# Altium schematic sheet [4] TFT LCD.SchDoc: TFT LCD
size A4; ApprovedBy: Muhammet YILDIZ; CheckedBy: Muhammet YILDIZ; Author: Muhammet YILDIZ; CompanyName: YıLDıZ IoT; DrawnBy: Muhammet YILDIZ; Engineer: Muhammet YILDIZ; Organization: YıLDıZ IoT; Address1: Elperek Mahallesi; Address2: Saray Sokak No:12; Address3: SAKARYA / TURKEY; Revision: 1; SheetNumber: 4; SheetTotal: 7; SheetSize: A4
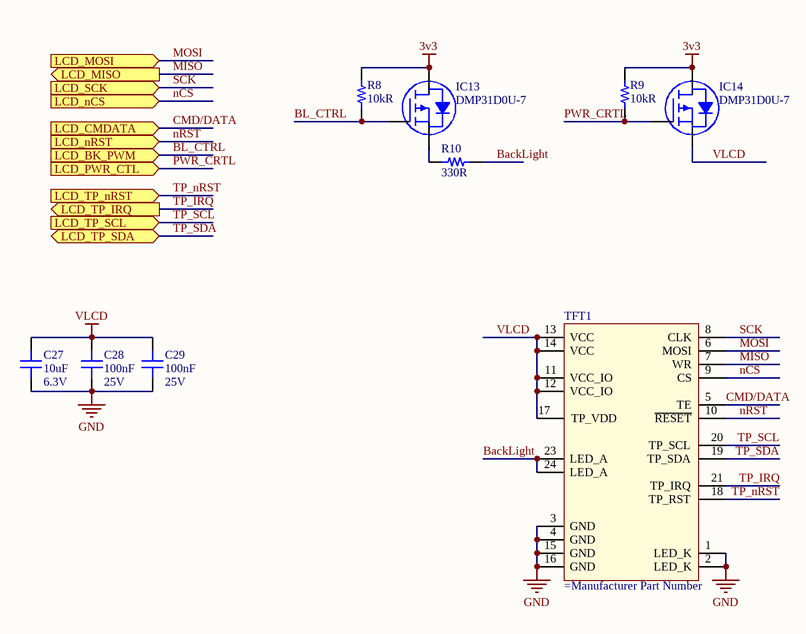
[diagram p0: [4] TFT LCD.SchDoc]

## Parts
C27  10uF  Voltage Rating: 6.3V  [CAP 0402/1005]
C28  100nF  Voltage Rating (DC): 25V  [CAP 0402/1005]
C29  100nF  Voltage Rating (DC): 25V  [CAP 0402/1005]
IC13  DMP31D0U-7  [DIODES SOT-23-3]
IC14  DMP31D0U-7  [DIODES SOT-23-3]
R8  10kR  [RES 0402/1005]
R9  10kR  [RES 0402/1005]
R10  330R  [RES 0402/1005]
TFT1  (no value)  [EASTRISE ER-TFT1.28-2]

## Ports
LCD_BK_PWM (in), LCD_CMDATA (in), LCD_MISO (out), LCD_MOSI (in), LCD_nCS (in), LCD_nRST (in), LCD_PWR_CTL (in), LCD_SCK (in), LCD_TP_IRQ (out), LCD_TP_nRST (in), LCD_TP_SCL (in), LCD_TP_SDA (bidir)

## Nets
3v3: IC13.3(D) IC14.3(D) R8.2 R9.2
GND: C27.1 C28.1 C29.1 TFT1.1(LED_K) TFT1.2(LED_K) TFT1.3(GND) TFT1.4(GND) TFT1.15(GND) TFT1.16(GND)
VLCD: C27.2 C28.2 C29.2 IC14.2(S) TFT1.11(VCC_IO) TFT1.12(VCC_IO) TFT1.13(VCC) TFT1.14(VCC) TFT1.17(TP_VDD)
BackLight: R10.2 TFT1.23(LED_A) TFT1.24(LED_A)
BL_CTRL: IC13.1(G) R8.1 ; port LCD_BK_PWM
CMD/DATA: TFT1.5(TE) ; port LCD_CMDATA
MISO: TFT1.7(WR) ; port LCD_MISO
MOSI: TFT1.6(MOSI) ; port LCD_MOSI
nCS: TFT1.9(CS) ; port LCD_nCS
nRST: TFT1.10(~{RESET}) ; port LCD_nRST
PWR_CRTL: IC14.1(G) R9.1 ; port LCD_PWR_CTL
SCK: TFT1.8(CLK) ; port LCD_SCK
TP_IRQ: TFT1.21(TP_IRQ) ; port LCD_TP_IRQ
TP_nRST: TFT1.18(TP_RST) ; port LCD_TP_nRST
TP_SCL: TFT1.20(TP_SCL) ; port LCD_TP_SCL
TP_SDA: TFT1.19(TP_SDA) ; port LCD_TP_SDA
NetIC13_2: IC13.2(S) R10.1

## Notes on the sheet
- Title:
- Size:
- Project:
- Revision:
- Sheet
- of
- Date:
- YıLDıZ IoT
- Elperek Mahallesi
- Saray Sokak, No:12
- SAKARYA / TURKEY
- File:

## Library data of the parts
C27 = Capacitor - Ceramic: 0402 10 uF 6.3 V ±20 % Tolerance X5R Surface Mount Multilayer Ceramic Capacitor; Manufacturer: Murata; Manufacturer Part Number: GRM155R60J106ME15D; Tolerance: 20%; Supplier 1: Digi-Key; Supplier Part Number 1: 490-13238-1-ND; RoHS: Yes; Category: Ceramic Capacitors; Pricing 1: 1=0,18000, 10=0,12400, 50=0,07440, 100=0,06280, 500=0,04296, 1000=0,03800, 2500=0,03635, 5000=0,03304 (USD); Mount: Surface Mount; Case/Package: 0402; Case Code (Metric): 1005; Case Code (Imperial): 0402; Min Operating Temperature: -55°C; Max Operating Temperature: 85°C; Packaging: Tape and Reel; Capacitance: 10uF; Voltage Rating (DC): 6.3V; Dielectric: X5R; Length: 0.039inch; Width: 0.02inch; Thickness: 0.026inch; RoHS Compliant: Yes; ComponentLink1URL: https://www.murata.com/~/media/webrenewal/support/library/catalog/products/capacitor/mlcc/c02e.ashx?la=en-us&src-supplier=Digi-Key; ComponentLink1Description: https://www.murata.com/~/media/webrenewal/support/library/catalog/products/capacitor/mlcc/c02e.ashx?la=en-us&src-supplier=Digi-Key
C28 C29 = Capacitor - Ceramic: Cap Ceramic 0.1uF 25V X5R 10% Pad SMD 0402 85¡ãC T/R / Multi Layer Ceramic Capacitor (MLCC); Manufacturer: Samsung; Manufacturer Part Number: CL05A104KA5NNNC; Supplier 1: Digi-Key; Supplier Part Number 1: 1276-1043-6-ND; RoHS: Yes; Category: Ceramic Capacitors; Pricing 1: 1=0,10000, 10=0,01100, 50=0,00600, 100=0,00490, 500=0,00346, 1000=0,00272, 2500=0,00248, 5000=0,00228 (USD); Mount: Surface Mount; Case/Package: 0402; Case Code (Imperial): 0402; Case Code (Metric): 1005; Min Operating Temperature: -55°C; Max Operating Temperature: 85°C; Capacitance: 100nF; Packaging: Tape and Reel; Tolerance: 10%; Package Quantity: 1; Voltage Rating: 25V; Dielectric: X5R; Voltage: 25V; Length: 1mm; Width: 0.02inch; Height: 0.5mm; Thickness: 0.022inch; Depth: 0.5mm; Radiation Hardening: No; Lead Free: Lead Free; ComponentLink1URL: https://datasheet.ciiva.com/25802/cl05a104ka5nnnc-25802704.pdf?src-supplier=Digi-Key; ComponentLink1Description: https://datasheet.ciiva.com/25802/cl05a104ka5nnnc-25802704.pdf?src-supplier=Digi-Key; ComponentLink2URL: https://datasheet.ciiva.com/16437/cl05a104ka5nnnc-16437369.pdf?src-supplier=Future+Electronics; ComponentLink2Description: https://datasheet.ciiva.com/16437/cl05a104ka5nnnc-16437369.pdf?src-supplier=Future+Electronics; ComponentLink3URL: https://datasheet.ciiva.com/26838/getdatasheetpartid-357412-26838142.pdf?src-supplier=Verical; ComponentLink3Description: https://datasheet.ciiva.com/26838/getdatasheetpartid-357412-26838142.pdf?src-supplier=Verical; ComponentLink4URL: https://datasheet.ciiva.com/26309/mlcc-catalogdownload2013-eng-26309014.pdf?src-supplier=Distrelec; ComponentLink4Description: https://datasheet.ciiva.com/26309/mlcc-catalogdownload2013-eng-26309014.pdf?src-supplier=Distrelec
IC13 IC14 = DMP31D0U-7: MOSFET P-CH 30V 530MA SOT23; Manufacturer: Diodes Incorporated; Current - Continuous Drain (Id) @ 25°C: 530mA (Ta); Drive Voltage (Max Rds On,  Min Rds On): 1.8V, 4.5V; FET Type: P-Channel; Gate Charge (Qg) (Max) @ Vgs: 0.9nC @ 4.5V; Input Capacitance (Ciss) (Max) @ Vds: 76pF @ 15V; Power Dissipation (Max): 450mW (Ta); Rds On (Max) @ Id, Vgs: 1Ohm @ 400mA, 4.5V; Vgs (Max): ±8V; Vgs(th) (Max) @ Id: 1.1V @ 250µA; Part Number: DMP31D0U-7; ComponentLink1Description: Datasheet; ComponentLink1URL: https://www.diodes.com/assets/Datasheets/DMP31D0U.pdf; ComponentLink2Description: DigiKey Link; ComponentLink2URL: http://digikey.com/product-detail/en/diodes-incorporated/DMP31D0U-7/DMP31D0U-7DICT-ND/4457888; Drain to Source Voltage (Vdss): 30V; LastUpdated: 02.09.2020 01:25:04; Lifecycle Status: Active; Minimum Order: 1; Mounting Type: Surface Mount; Operating Temperature: -55°C ~ 150°C (TJ); Package / Case: TO-236-3, SC-59, SOT-23-3; Packaging: TapeAndReel; Part Status: Active; Price: 0.09; Series: -; Supplier 1: DigiKey; Supplier Part Number 1: DMP31D0U-7DICT-ND; Supplier Device Package: SOT-23; Technology: MOSFET (Metal Oxide)
R8 R9 = Resistor_Chip: Res Thick Film 0402 10K Ohm 1% 0.063W(1/16W) ±100ppm/C Pad SMD Automotive T/R; Manufacturer: Stackpole Electronics; Manufacturer Part Number: RMCF0402FT10K0; Power Rating: 62.5mW; Temperature Coefficient: 100ppm/°C; Max Power Dissipation: 63mW; Supplier 1: Digi-Key; Supplier Part Number 1: RMCF0402FT10K0DKR-ND; RoHS: Yes; Category: Chip SMD Resistors; Pricing 1: 1=0,10000, 10=0,01500, 100=0,00610, 1000=0,00274, 2500=0,00238, 5000=0,00197 (USD); Mount: Surface Mount; Case/Package: 0402; Case Code (Metric): 1005; Case Code (Imperial): 0402; Contact Plating: Tin,Matte; Size Code: 0402; Min Operating Temperature: -55°C; Max Operating Temperature: 155°C; Tolerance: 1%; Packaging: Tape and Reel; Resistance: 10kR; Resistor Type: Thick Film; Number of Terminations: 2; Features: Automotive AEC-Q200; Series: RMCF; Construction: Rectangular; Length: 1mm; Width: 0.02inch; Height: 0.016inch; Depth: 0.5mm; Radiation Hardening: No; Military Standard: Not; Lead Free: Lead Free; RoHS Compliant: Yes; ComponentLink1URL: https://datasheet.ciiva.com/24341/sei-rmcp-24341800.pdf?src-supplier=Onlinecomponents.com; ComponentLink1Description: https://datasheet.ciiva.com/24341/sei-rmcp-24341800.pdf?src-supplier=Onlinecomponents.com
R10 = Resistor_Chip: Res Thick Film 0402 330 Ohm 1% 0.063W(1/16W) ±100ppm/C Pad SMD T/R; Manufacturer: Walsin Technologies; Manufacturer Part Number: WR04X3300FTL; Voltage Rating: 50V; Power Rating: 62.5mW; Temperature Coefficient: 100ppm/°C; Supplier 1: Digi-Key; Supplier Part Number 1: 1292-WR04X3300FTLCT-ND; RoHS: Yes; Category: Chip SMD Resistors; Stock 1: 3930; Pricing 1: 1=0,10000, 10=0,01000, 100=0,00360, 1000=0,00162, 2500=0,00140, 5000=0,00116 (USD); Case/Package: Molded; Case Code (Metric): 1005; Case Code (Imperial): 0402; Contact Material: Tin; Min Operating Temperature: -55°C; Max Operating Temperature: 155°C; Packaging: Tape and Reel; Resistance: 330R; Tolerance: 1%; Resistor Type: Thick Film,Metal Oxide; Voltage Rating (DC): 50V; Length: 1mm; Depth: 0.5mm; REACH SVHC: Unknown; Military Standard: Not; Lead Free: Lead Free; RoHS Compliant: Yes; ComponentLink1URL: http://www.farnell.com/datasheets/1960319.pdf?src-supplier=Farnell; ComponentLink1Description: http://www.farnell.com/datasheets/1960319.pdf?src-supplier=Farnell; ComponentLink2URL: https://www.verical.com/server-webapp/html/getDatasheet?partID=413958&src-supplier=Verical; ComponentLink2Description: https://www.verical.com/server-webapp/html/getDatasheet?partID=413958&src-supplier=Verical; ComponentLink3URL: http://components.arrow.com/part/dataview/0323_00666659?src-supplier=Arrow+Europe; ComponentLink3Description: http://components.arrow.com/part/dataview/0323_00666659?src-supplier=Arrow+Europe; ComponentLink4URL: http://www.farnell.com/datasheets/1960319.pdf?src-supplier=Element14; ComponentLink4Description: http://www.farnell.com/datasheets/1960319.pdf?src-supplier=Element14
TFT1 = EASTRISE ER-TFT1.28-2: ER-TFT1.28-2 TFT LCD Display Datasheet